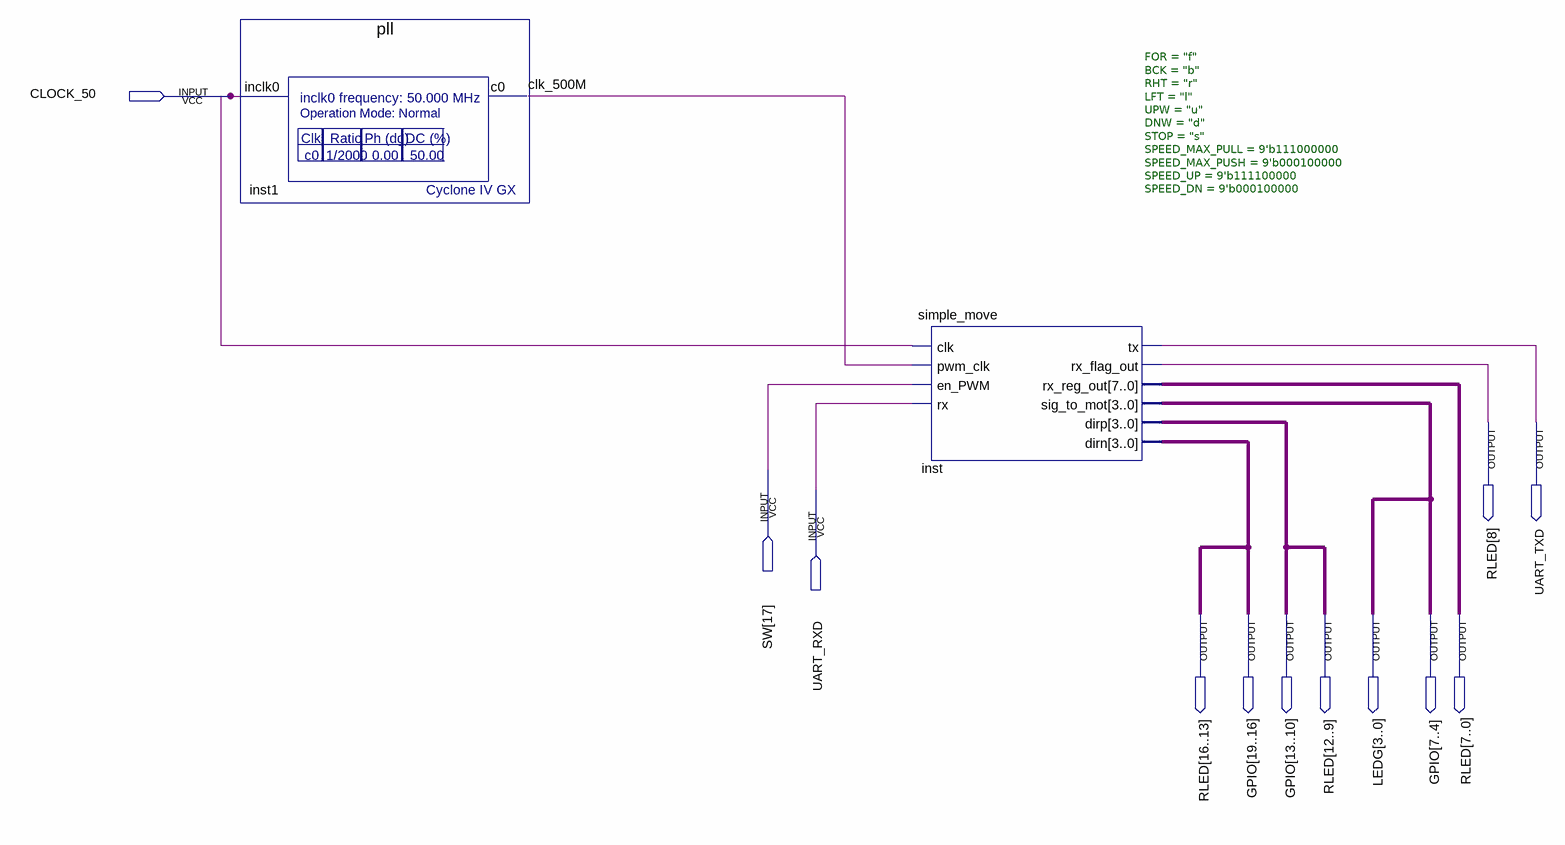
[diagram p0: schematic sheet]
// Quartus schematic my_first_fpga.bdf as structural Verilog: 2 symbols, 12 pins
module my_first_fpga (
  input  CLOCK_50,
  input  [17:17] SW,
  input  UART_RXD,
  output [16:0] RLED,
  output UART_TXD,
  output [19:4] GPIO,
  output [3:0] LEDG
);

  wire clk_500M;

  pll inst1 (.inclk0(CLOCK_50), .c0(clk_500M));
  simple_move #(.FOR("f"), .BCK("b"), .RHT("r"), .LFT("l"), .UPW("u"), .DNW("d"), .STOP("s"), .SPEED_MAX_PULL(9'b111000000), .SPEED_MAX_PUSH(9'b000100000), .SPEED_UP(9'b111100000), .SPEED_DN(9'b000100000)) inst (
    .clk(CLOCK_50), .pwm_clk(clk_500M), .en_PWM(SW[17]), .rx(UART_RXD), .tx(UART_TXD), .rx_flag_out(RLED[8]),
    .rx_reg_out(RLED[7:0]), .sig_to_mot(GPIO[7:4]), .dirp(GPIO[13:10]), .dirn(GPIO[19:16]));

  assign LEDG = GPIO[7:4];
  assign RLED[16:9] = {GPIO[19:16], GPIO[13:10]};
endmodule
